# Altium schematic sheet DM1098OAKW_IMX378.SchDoc: =project_title
size Tabloid; PageSetup: Record=PageOptions|CenterHorizontal=True|CenterVertical=True|PrintScale=0.71|XCorrection=1.00|YCorrection=1.00|PrintKind=0|BorderSize=5000000|LeftOffset=0|BottomOffset=0|Orientation=2|PaperLength=1000|PaperWidth=1000|Scale=100|PaperSource=7|PrintQuality=-4|MediaType=1|DitherType=10|PrintScaleMode=1|PaperKind=A4; CompanyName: Luxonis Holding; Organization: Luxonis Holding; Address1: 1925 Harmony Park Drive; Address2: Westminster, CO; Address3: 80234; Address4: United States; SheetNumber: 4; SheetTotal: 12
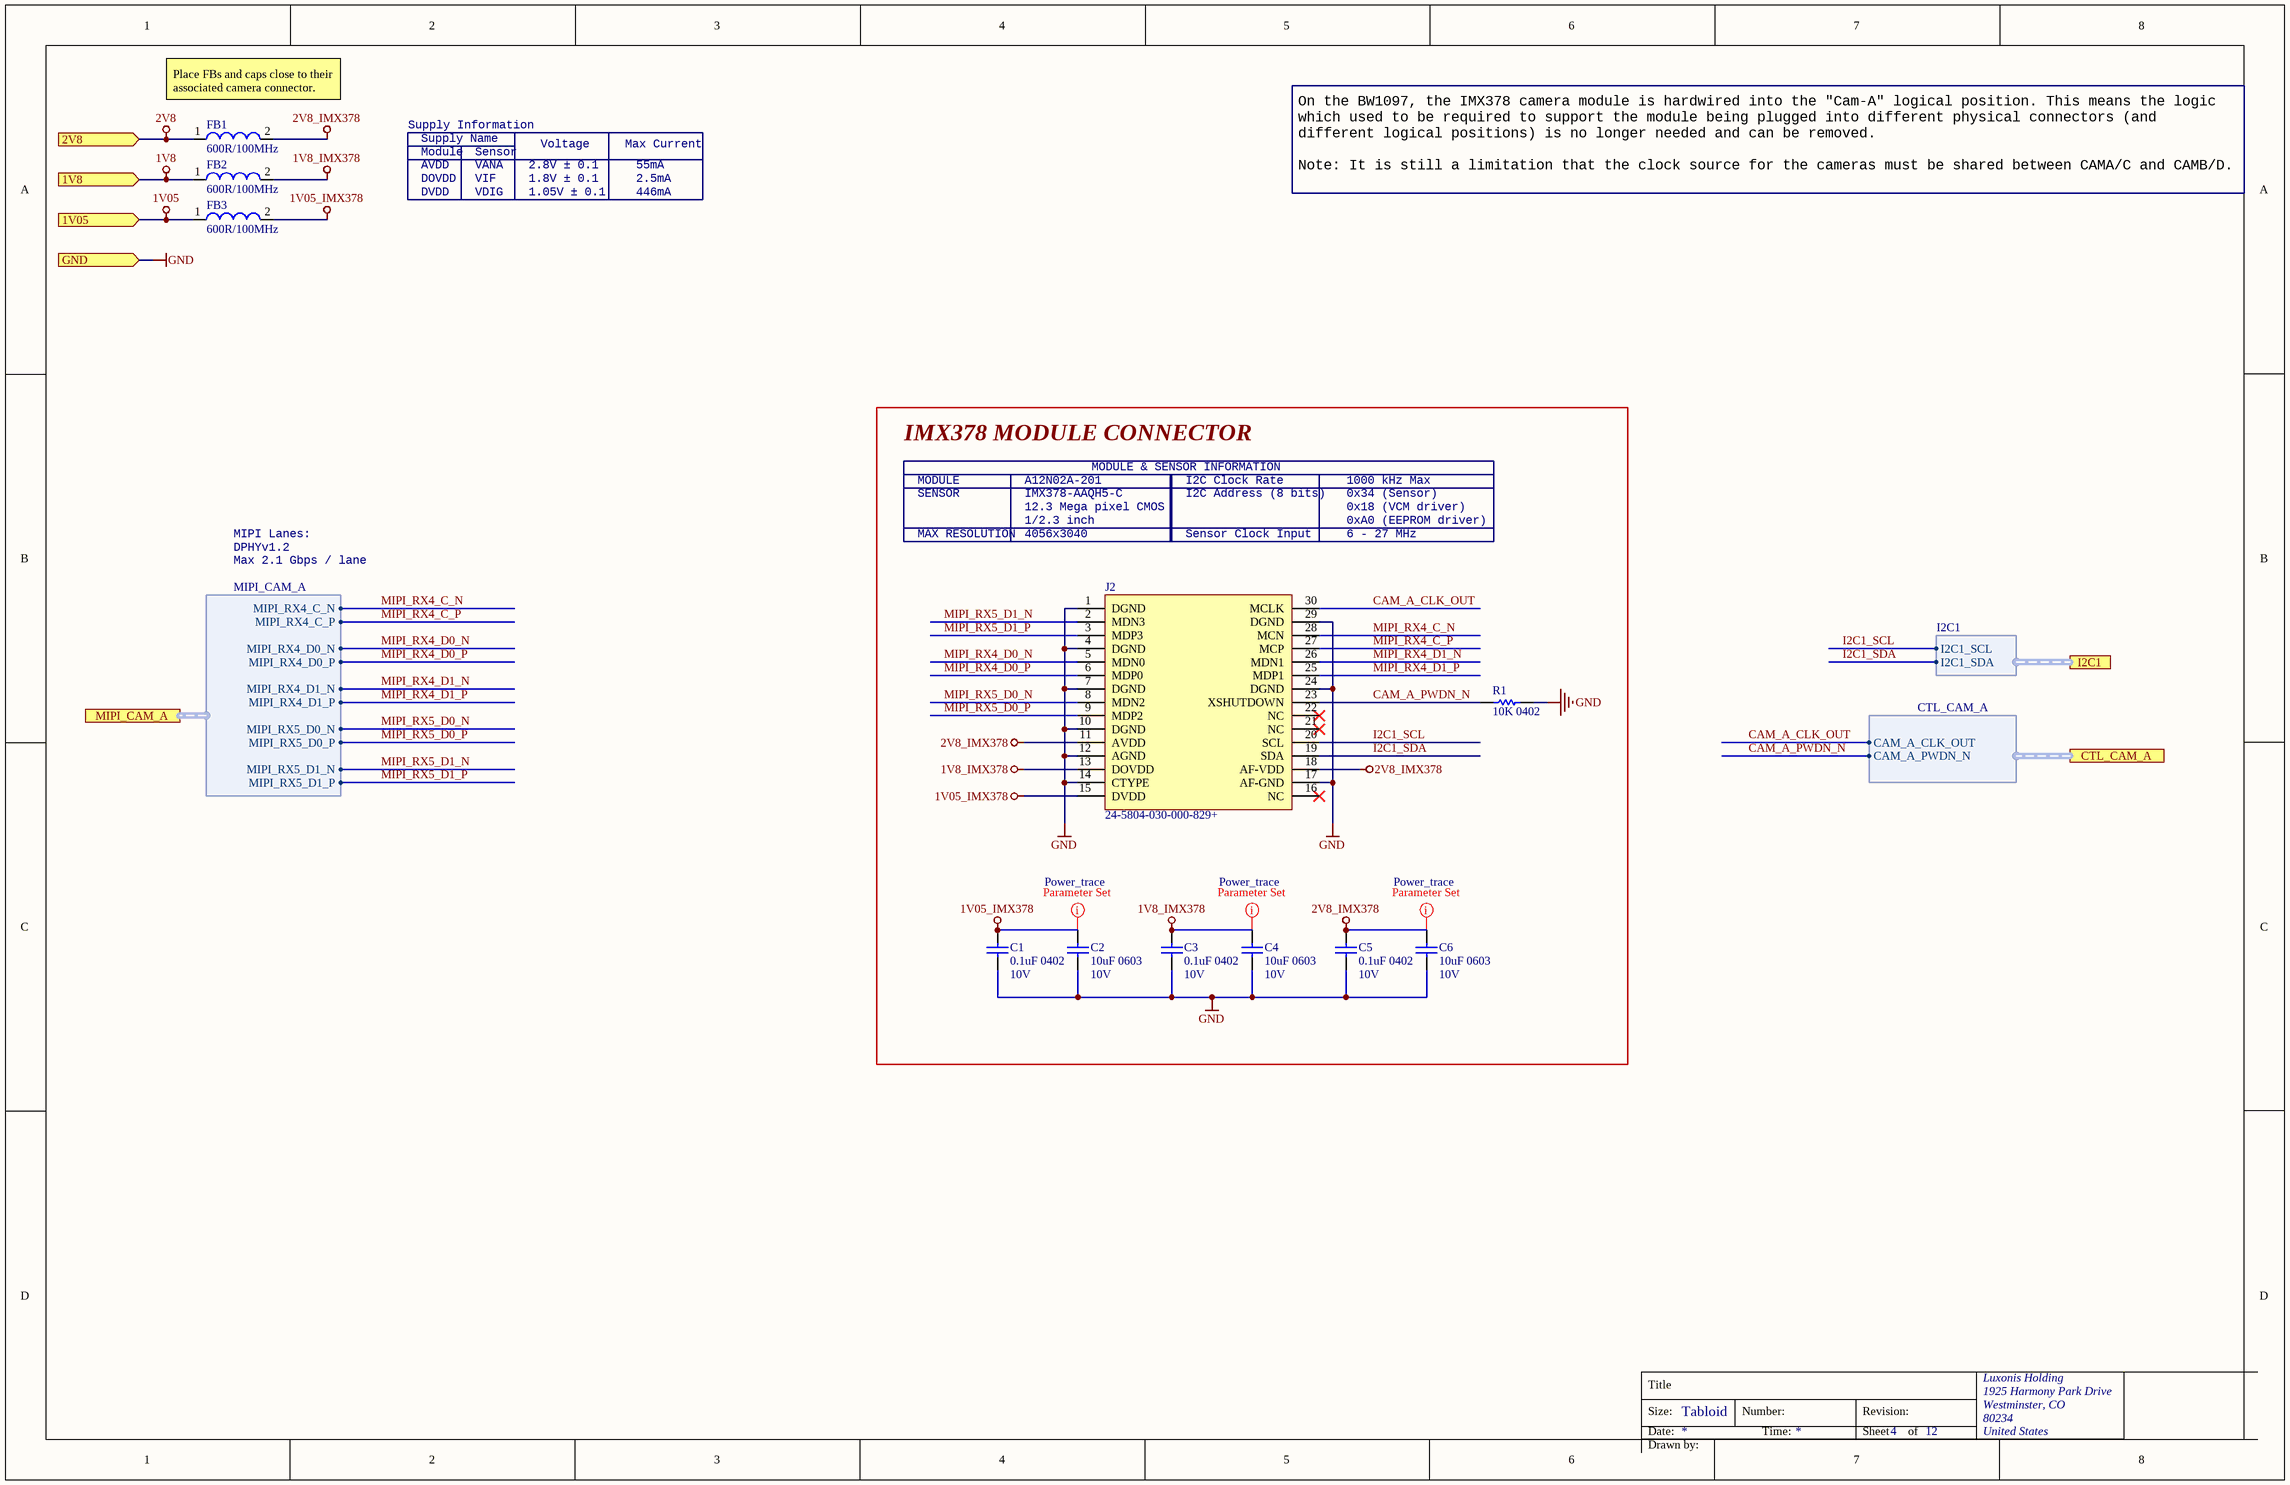
[diagram p0: DM1098OAKW_IMX378.SchDoc]

## Parts
C1  0.1uF 0402  Voltage Rating: 10V  [CAPC0402(1005)70_L]
C2  10uF 0603  Voltage Rating: 10V  [CAPC0603(1608)100_L]
C3  0.1uF 0402  Voltage Rating: 10V  [CAPC0402(1005)70_L]
C4  10uF 0603  Voltage Rating: 10V  [CAPC0603(1608)100_L]
C5  0.1uF 0402  Voltage Rating: 10V  [CAPC0402(1005)70_L]
C6  10uF 0603  Voltage Rating: 10V  [CAPC0603(1608)100_L]
FB1  600R/100MHz  [2508056017Y2]
FB2  600R/100MHz  [2508056017Y2]
FB3  600R/100MHz  [2508056017Y2]
J2  24-5804-030-000-829+  [A12N02A-201_1.6mmbrd_MatedModule]
R1  10K 0402  [RESC0402(1005)_L]

## Blocks framed on the sheet
IMX378 MODULE CONNECTOR: C1-C6 J2 R1

## Ports
1V05 (in), 1V8 (in), 2V8 (in), CTL_CAM_A (harness CTL_CAM_A), GND (in), I2C1 (harness I2C1), MIPI_CAM_A (harness MIPI_CAM_A)

## Harnesses
I2C1: I2C1_SDA, I2C1_SCL
MIPI_CAM_A: MIPI_RX4_C_P, MIPI_RX4_C_N, MIPI_RX4_D0_P, MIPI_RX4_D0_N, MIPI_RX4_D1_P, MIPI_RX4_D1_N, MIPI_RX5_D0_P, MIPI_RX5_D0_N, MIPI_RX5_D1_P, MIPI_RX5_D1_N
CTL_CAM_A: CAM_A_PWDN_N, CAM_A_CLK_OUT

## Nets
1V05: FB3.1 ; port 1V05
1V05_IMX378: C1.2 C2.2 FB3.2 J2.15(DVDD)
1V8: FB2.1 ; port 1V8
1V8_IMX378: C3.2 C4.2 FB2.2 J2.13(DOVDD)
2V8: FB1.1 ; port 2V8
2V8_IMX378: C5.2 C6.2 FB1.2 J2.11(AVDD) J2.18(AF-VDD)
GND: C1.1 C2.1 C3.1 C4.1 C5.1 C6.1 J2.1(DGND) J2.4(DGND) J2.7(DGND) J2.10(DGND) J2.12(AGND) J2.14(CTYPE) J2.17(AF-GND) J2.24(DGND) J2.29(DGND) R1.2 ; port GND
CAM_A_CLK_OUT: J2.30(MCLK) ; port CTL_CAM_A.CAM_A_CLK_OUT
CAM_A_PWDN_N: J2.23(XSHUTDOWN) R1.1 ; port CTL_CAM_A.CAM_A_PWDN_N
I2C1_SCL: J2.20(SCL) ; port I2C1.I2C1_SCL
I2C1_SDA: J2.19(SDA) ; port I2C1.I2C1_SDA
MIPI_RX4_C_N: J2.28(MCN) ; port MIPI_CAM_A.MIPI_RX4_C_N
MIPI_RX4_C_P: J2.27(MCP) ; port MIPI_CAM_A.MIPI_RX4_C_P
MIPI_RX4_D0_N: J2.5(MDN0) ; port MIPI_CAM_A.MIPI_RX4_D0_N
MIPI_RX4_D0_P: J2.6(MDP0) ; port MIPI_CAM_A.MIPI_RX4_D0_P
MIPI_RX4_D1_N: J2.26(MDN1) ; port MIPI_CAM_A.MIPI_RX4_D1_N
MIPI_RX4_D1_P: J2.25(MDP1) ; port MIPI_CAM_A.MIPI_RX4_D1_P
MIPI_RX5_D0_N: J2.8(MDN2) ; port MIPI_CAM_A.MIPI_RX5_D0_N
MIPI_RX5_D0_P: J2.9(MDP2) ; port MIPI_CAM_A.MIPI_RX5_D0_P
MIPI_RX5_D1_N: J2.2(MDN3) ; port MIPI_CAM_A.MIPI_RX5_D1_N
MIPI_RX5_D1_P: J2.3(MDP3) ; port MIPI_CAM_A.MIPI_RX5_D1_P

Not connected (* = marked no-connect by the designer): J2 16(NC)* 21(NC)* 22(NC)*

## Layout directives
net class Power_trace: 1V05_IMX378, 1V8_IMX378, 2V8_IMX378

## Notes on the sheet
- (near FB1) Place FBs and caps close to their associated camera connector.
- Supply Information
- AVDD
- Supply Name
- Module
- VANA
- Sensor
- 2.8V ± 0.1
- Voltage
- Max Current
- 55mA
- DOVDD
- DVDD
- VIF
- VDIG
- 1.8V ± 0.1
- 1.05V ± 0.1
- 2.5mA
- 446mA
- On the BW1097, the IMX378 camera module is hardwired into the "Cam-A" logical position. This means the logic which used to be required to support the module being plugged into different physical connectors (and different logical positions) is no longer needed and can be removed.
  Note: It is still a limitation that the clock source for the cameras must be shared between CAMA/C and CAMB/D.
- SENSOR
- MODULE
- IMX378-AAQH5-C
- A12N02A-201
- MODULE & SENSOR INFORMATION
- I2C Address (8 bits)
- I2C Clock Rate
- 0x34 (Sensor)
- 1000 kHz Max
- MIPI Lanes:
- Max 2.1 Gbps / lane
- DPHYv1.2
- MAX RESOLUTION
- 12.3 Mega pixel CMOS
- 4056x3040
- 1/2.3 inch
- Sensor Clock Input
- 0x18 (VCM driver)
- 0xA0 (EEPROM driver)
- 6 - 27 MHz
- Title
- Size:
- Date:
- Tabloid
- Number:
- Time:
- Revision:
- Sheet
- of
- Drawn by:

## Library data of the parts
C1 C3 C5 = GRM155R71A104JA01D: CAP CER 0.1UF 10V X7R 0402 5%; Manufacturer 1: Murata; Capacitance: 100nF; Supplier 1: Digi-Key; Manufacturer Part Number 1: GRM155R71A104JA01D; Stock 1: 1346709; Pricing 1: 1=0.10000, 10=0.02500, 100=0.01130, 500=0.00806, 1000=0.00633, 2500=0.00575, 5000=0.00529 (USD); RoHS: Yes; Mount: Surface Mount; Case/Package: 0402; Case Code (Imperial): 0402; Case Code (Metric): 1005; Min Operating Temperature: -55°C; Max Operating Temperature: 125°C; Tolerance: 5%; Packaging: Tape and Reel; Voltage Rating (DC): 10V; Dielectric: X7R; Package Quantity: 10000; Termination: SMD/SMT; Length: 1mm; Height: 0.5mm; Width: 0.02inch; Thickness: 0.022inch; Depth: 0.5mm; Radiation Hardening: No; Lead Free: Lead Free; ComponentLink1URL: https://datasheet.ciiva.com/5411/product-5411135.pdf?src-supplier=Mouser; ComponentLink1Description: https://datasheet.ciiva.com/5411/product-5411135.pdf?src-supplier=Mouser; ComponentLink2URL: https://datasheet.ciiva.com/11618/c02e-11618821.pdf?src-supplier=Avnet; ComponentLink2Description: https://datasheet.ciiva.com/11618/c02e-11618821.pdf?src-supplier=Avnet; Supplier Part Number 1: 490-10777-1-ND
C2 C4 C6 = GRM188R61A106ME69D: CAP CER 10UF 10V X5R 0603 20%; Manufacturer 1: Murata; Material: Ceramic; Supplier 1: Digi-Key; Manufacturer Part Number 1: GRM188R61A106ME69D; Stock 1: 2873098; Pricing 1: 1=0.21000, 10=0.14100, 100=0.07130, 500=0.04876, 1000=0.04313 (USD); RoHS: Yes; Mount: Surface Mount; Case/Package: 0603; Weight: 0.000222oz; Case Code (Metric): 1608; Case Code (Imperial): 0603; Min Operating Temperature: -55°C; Max Operating Temperature: 85°C; Packaging: Tape and Reel; Tolerance: 20%; Capacitance: 10uF; Dielectric: X5R; Voltage Rating (DC): 10V; Package Quantity: 4000; Termination: SMD/SMT; Length: 1.6mm; Height: 0.8mm; Width: 0.8mm; Thickness: 0.035inch; Depth: 0.8mm; REACH SVHC: Unknown; Lead Free: Lead Free; ComponentLink1URL: http://www.mouser.com/ds/2/281/c02e-2905.pdf?src-supplier=Mouser; ComponentLink1Description: http://www.mouser.com/ds/2/281/c02e-2905.pdf?src-supplier=Mouser; ComponentLink2URL: http://components.arrow.com/part/dataview/0323_06119472?src-supplier=Arrow+Europe; ComponentLink2Description: http://components.arrow.com/part/dataview/0323_06119472?src-supplier=Arrow+Europe; ComponentLink3URL: http://www.farnell.com/datasheets/2048014.pdf?src-supplier=Farnell; ComponentLink3Description: http://www.farnell.com/datasheets/2048014.pdf?src-supplier=Farnell; ComponentLink4URL: http://www.farnell.com/datasheets/1872210.pdf?src-supplier=Farnell; ComponentLink4Description: http://www.farnell.com/datasheets/1872210.pdf?src-supplier=Farnell; ComponentLink5URL: http://search.murata.co.jp/Ceramy/image/img/A01X/G101/ENG/GRM188R61A106ME69-01.pdf?src-supplier=Digi-Key; ComponentLink5Description: http://search.murata.co.jp/Ceramy/image/img/A01X/G101/ENG/GRM188R61A106ME69-01.pdf?src-supplier=Digi-Key; ComponentLink6URL: http://www.farnell.com/datasheets/1872210.pdf?src-supplier=Newark; ComponentLink6Description: http://www.farnell.com/datasheets/1872210.pdf?src-supplier=Newark; ComponentLink7URL: http://www.farnell.com/datasheets/2048014.pdf?src-supplier=Element14; ComponentLink7Description: http://www.farnell.com/datasheets/2048014.pdf?src-supplier=Element14; ComponentLink8URL: http://www.farnell.com/datasheets/2048014.pdf?src-supplier=Newark; ComponentLink8Description: http://www.farnell.com/datasheets/2048014.pdf?src-supplier=Newark; Supplier Part Number 1: 490-10475-1-ND
FB1-FB3 = 2508056017Y2: FERRITE BEAD, 0.1OHM, 2A, 0805, 600R/100MHz; Manufacturer 1: Fair-Rite; Impedance: 600R; Tolerance: 25%; Resistance: 350mR; DC Resistance (DCR): 100mR; Test Frequency: 100MHz; Supplier 1: Digi-Key; Manufacturer Part Number 1: 2508056017Y2; Stock 1: 100491; Pricing 1: 1=0.10000, 10=0.07900, 25=0.07120, 50=0.05240, 100=0.04520, 250=0.03568, 500=0.03014, 1000=0.02538 (USD); RoHS: Yes; Case/Package: 0805; Number of Pins: 2; Case Code (Metric): 2012; Case Code (Imperial): 0805; Min Operating Temperature: -55°C; Max Operating Temperature: 125°C; Package Quantity: 4000; Packaging: Tape and Reel; Max DC Current: 2A; Termination: SMD/SMT; Military Standard: Not; DC Current: 2A; Current Rating: 2A; Frequency: 100MHz; Length: 2mm; Height: 0.9mm; Width: 1.25mm; Depth: 1.25mm; Radiation Hardening: No; REACH SVHC: No SVHC; ComponentLink1URL: https://datasheet.ciiva.com/3854/3802508056017y2-3854245.pdf?src-supplier=Arrow; ComponentLink1Description: https://datasheet.ciiva.com/3854/3802508056017y2-3854245.pdf?src-supplier=Arrow; ComponentLink2URL: https://datasheet.ciiva.com/22735/652149-22735047.pdf?src-supplier=Element14; ComponentLink2Description: https://datasheet.ciiva.com/22735/652149-22735047.pdf?src-supplier=Element14; ComponentLink3URL: https://datasheet.ciiva.com/1127/26143-1127514.pdf?src-supplier=Farnell; ComponentLink3Description: https://datasheet.ciiva.com/1127/26143-1127514.pdf?src-supplier=Farnell; ComponentLink4URL: https://datasheet.ciiva.com/18090/getdatasheetpartid-212640-18090187.pdf?src-supplier=Verical; ComponentLink4Description: https://datasheet.ciiva.com/18090/getdatasheetpartid-212640-18090187.pdf?src-supplier=Verical; ComponentLink5URL: https://datasheet.ciiva.com/7620/26143-7620140.pdf?src-supplier=Element14; ComponentLink5Description: https://datasheet.ciiva.com/7620/26143-7620140.pdf?src-supplier=Element14; Supplier Part Number 1: 1934-1487-1-ND
J2 = A12N02A-201_Connector_(1.6mm_brd): CONN Series 5804 board to board 0.4mm pitch 30 way connector; Manufacturer 1: Kyocera International Electronic Components; Manufacturer Part Number 1: 245804030000829+; MAN: AVX/KYOCERA; MAN PN: 24-5804-030-000-829+; Supplier 1: Digi-Key; Stock 1: 11469; Pricing 1: 1=1.69000, 10=1.53600, 25=1.44200, 50=1.37940, 100=1.31670, 250=1.19132, 500=1.09726, 1000=0.94050 (USD); RoHS: Yes; ComponentLink1URL: http://global.kyocera.com/prdct/electro/product/pdf/5804.pdf?src-supplier=Digi-Key; ComponentLink1Description: http://global.kyocera.com/prdct/electro/product/pdf/5804.pdf?src-supplier=Digi-Key; Supplier Part Number 1: 478-12013-1-ND
R1 = RC0402FR-1310KL: RES SMD 10K OHM 1% 0402 1/16W Chip Resistor, 0402 [1005 Metric], 10 kohm, RC Series, 50 V, Thick Film, 62.5 mW; Manufacturer 1: Yageo; Resistance: 10kR; Temperature Coefficient: 100ppm/°C; Power Rating: 62.5mW; Voltage Rating: 50V; ComponentLink1URL: https://datasheet.ciiva.com/16940/pyu-rc0402-51-rohs-l-6-16940293.pdf?src-supplier=Avnet+Europe; ComponentLink1Description: https://datasheet.ciiva.com/16940/pyu-rc0402-51-rohs-l-6-16940293.pdf?src-supplier=Avnet+Europe; ComponentLink2URL: https://datasheet.ciiva.com/28386/pyu-rc0402-51-rohs-l-6-28386855.pdf?src-supplier=Avnet+Europe; ComponentLink2Description: https://datasheet.ciiva.com/28386/pyu-rc0402-51-rohs-l-6-28386855.pdf?src-supplier=Avnet+Europe; ComponentLink3URL: https://datasheet.ciiva.com/16740/pyu-rc0402-51-rohs-l-6-r-16740602.pdf?src-supplier=Future+Electronics; ComponentLink3Description: https://datasheet.ciiva.com/16740/pyu-rc0402-51-rohs-l-6-r-16740602.pdf?src-supplier=Future+Electronics; ComponentLink4URL: https://datasheet.ciiva.com/8891/pyu-rc0402-51-rohs-l-6-8891339.pdf?src-supplier=Avnet; ComponentLink4Description: https://datasheet.ciiva.com/8891/pyu-rc0402-51-rohs-l-6-8891339.pdf?src-supplier=Avnet; ComponentLink5URL: https://datasheet.ciiva.com/5557/pyu-rc0402-51-rohs-l-6-r-5557997.pdf?src-supplier=Mouser; ComponentLink5Description: https://datasheet.ciiva.com/5557/pyu-rc0402-51-rohs-l-6-r-5557997.pdf?src-supplier=Mouser; ComponentLink6URL: https://datasheet.ciiva.com/7983/1018594-7983533.pdf?src-supplier=Element14; ComponentLink6Description: https://datasheet.ciiva.com/7983/1018594-7983533.pdf?src-supplier=Element14; Supplier 1: Newark; Manufacturer Part Number 1: RC0402FR-1310KL; Stock 1: 62239; Pricing 1: 1=0.10000, 25=0.01200, 100=0.00400, 250=0.00400, 500=0.00300, 1000=0.00300 (USD); RoHS: Yes; Case/Package: 0402; Number of Pins: 2; Contact Plating: Tin,Matte,Lead; Case Code (Imperial): 0402; Case Code (Metric): 1005; Min Operating Temperature: -55°C; Max Operating Temperature: 155°C; Tolerance: 1%; Composition: Thick Film; Packaging: Tape and Reel; Termination: SMD/SMT; Military Standard: Not; Voltage Rating (DC): 50V; Working Voltage: 50V; Number of Terminations: 2; Length: 1mm; Depth: 0.5mm; Radiation Hardening: No; REACH SVHC: No SVHC; Lead Free: Lead Free; Supplier Part Number 1: 67R9960